# Altium schematic sheet 0256_GPU_VDDQ_VCCSAMC_V.SchDoc
size 848 x 558 mm
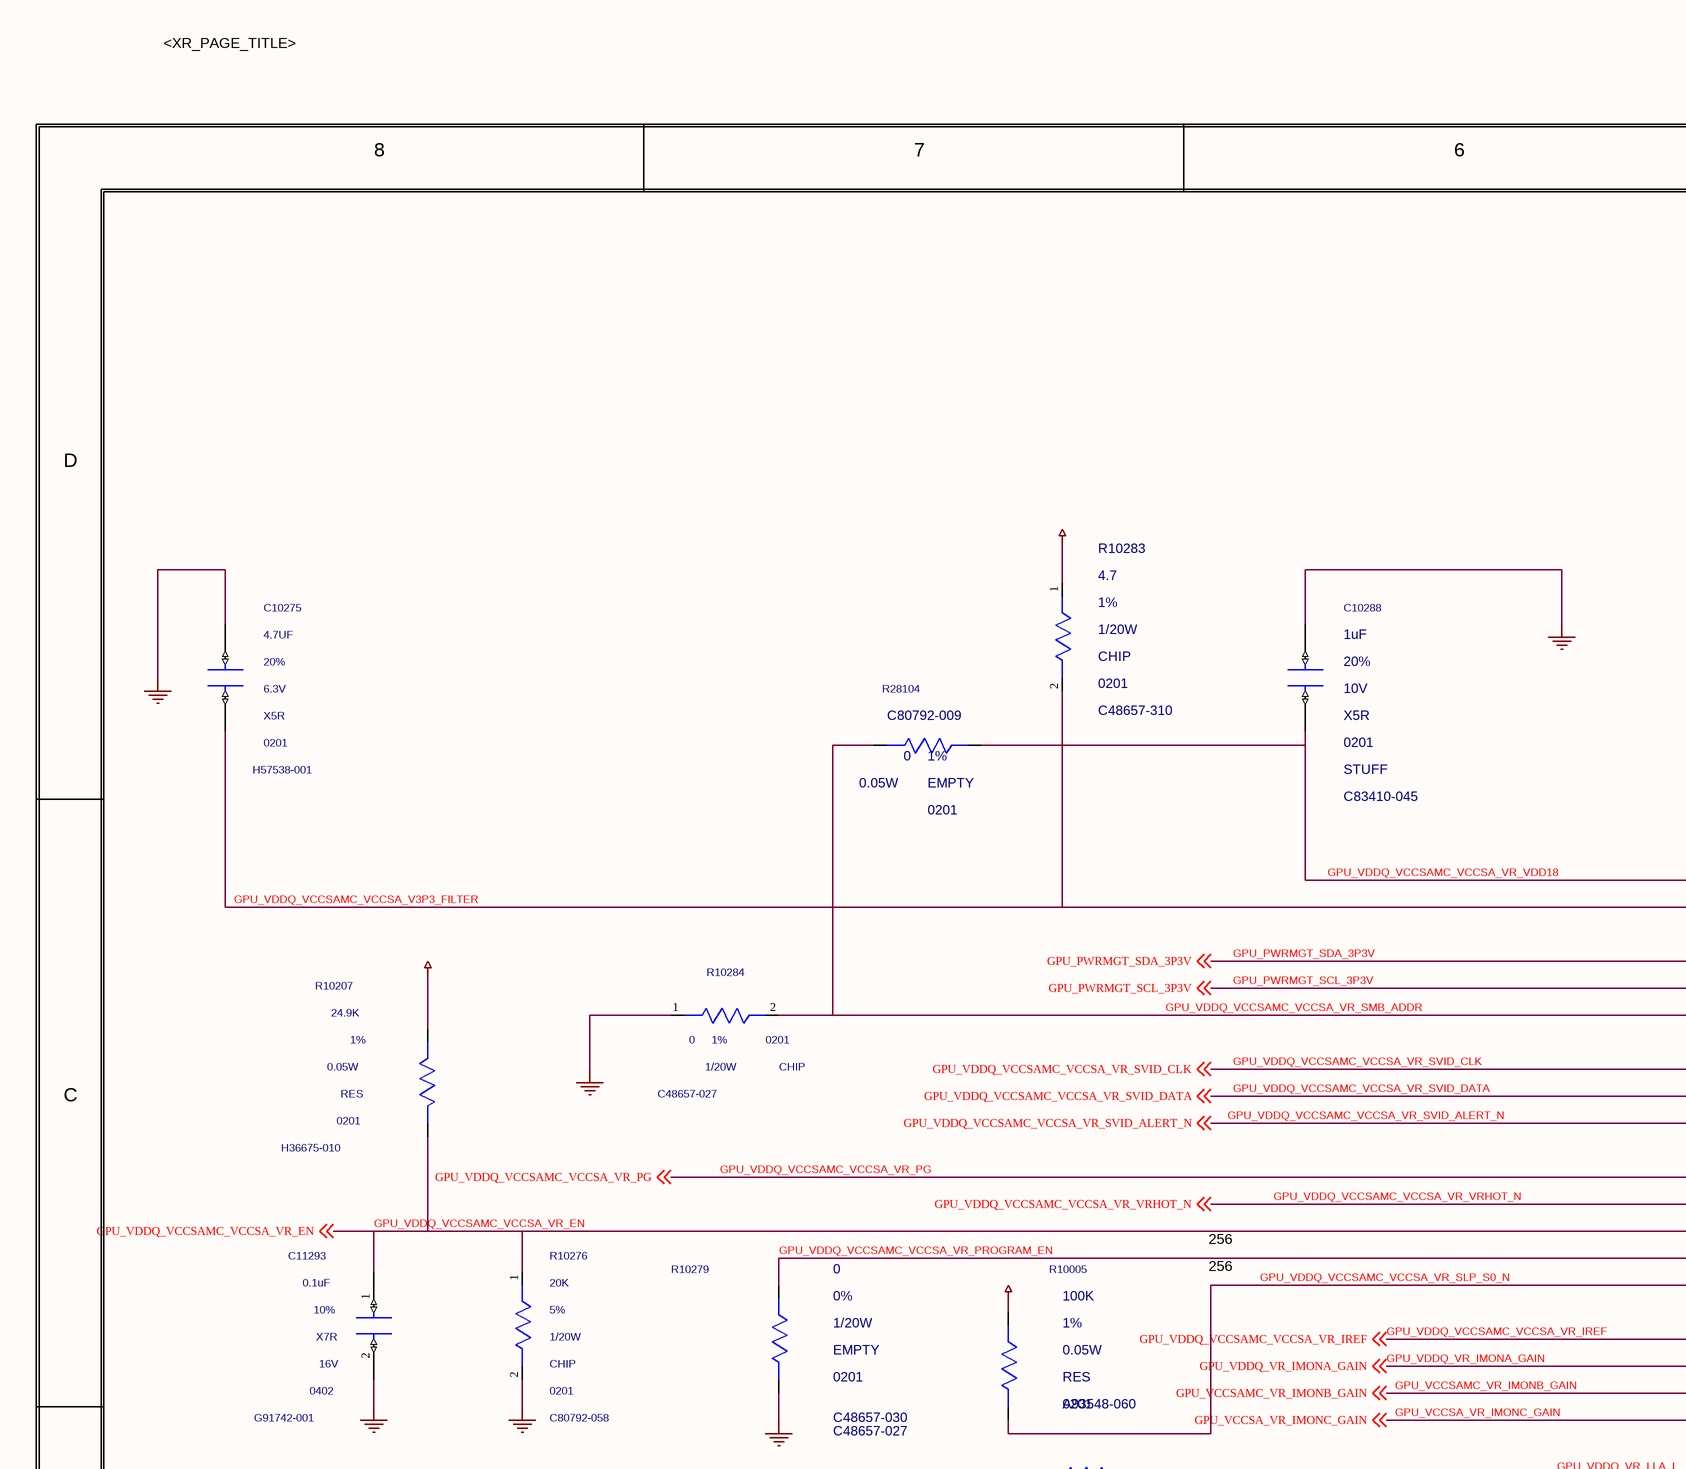
[diagram p0: 0256_GPU_VDDQ_VCCSAMC_V.SchDoc, top left]
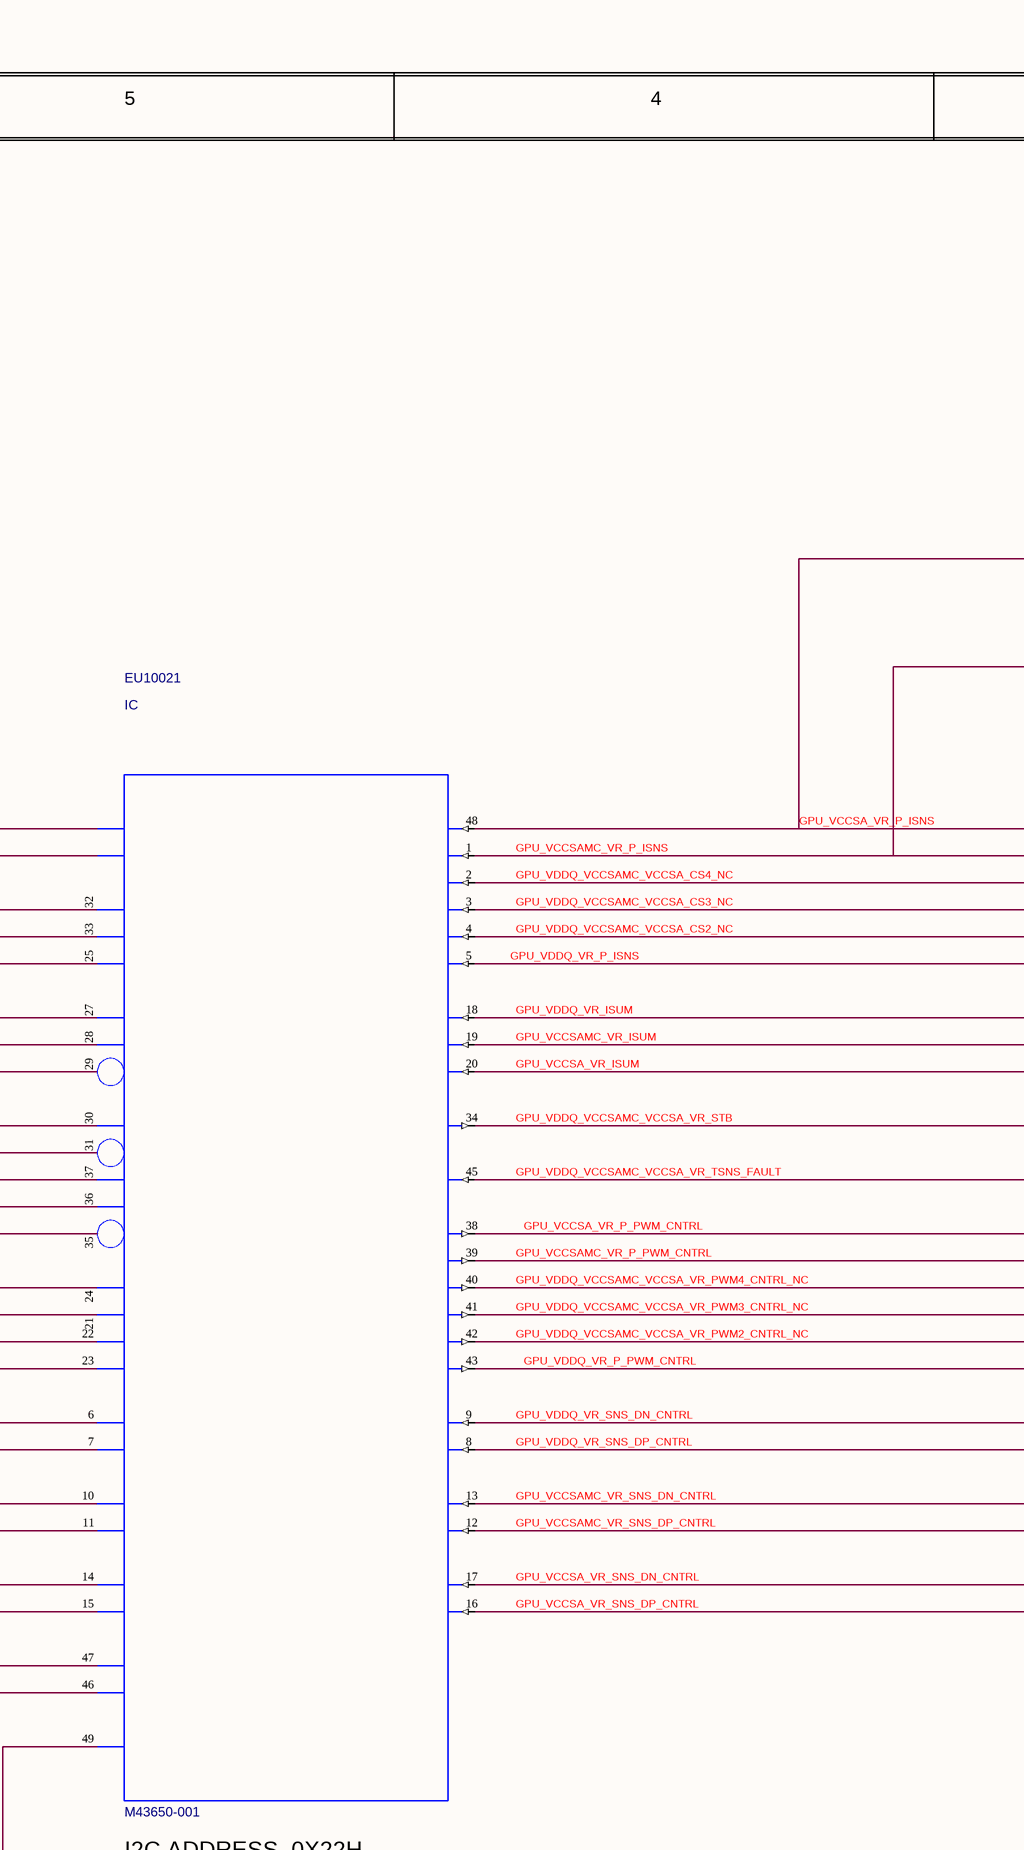
[diagram p1: 0256_GPU_VDDQ_VCCSAMC_V.SchDoc, top middle]
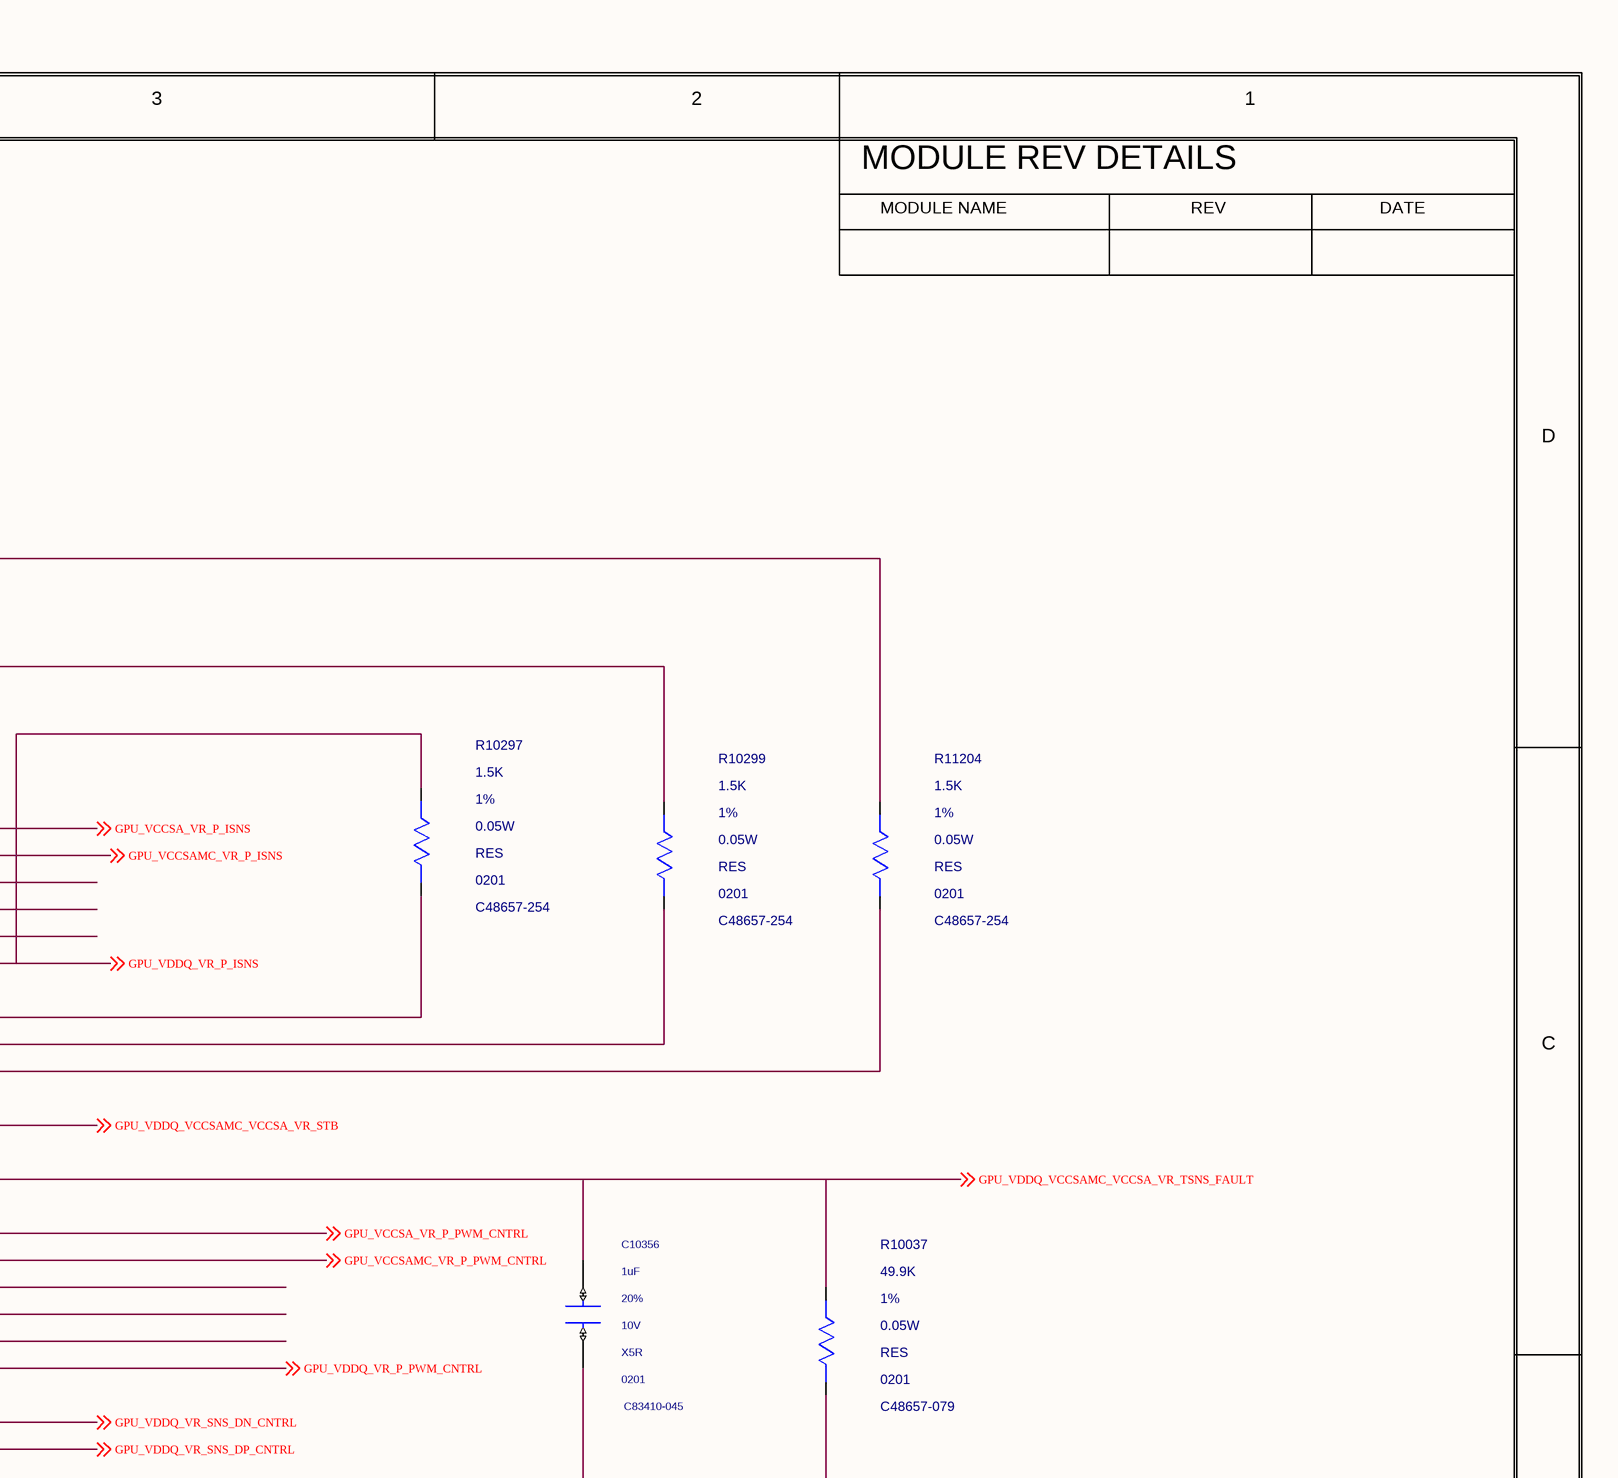
[diagram p2: 0256_GPU_VDDQ_VCCSAMC_V.SchDoc, top right]
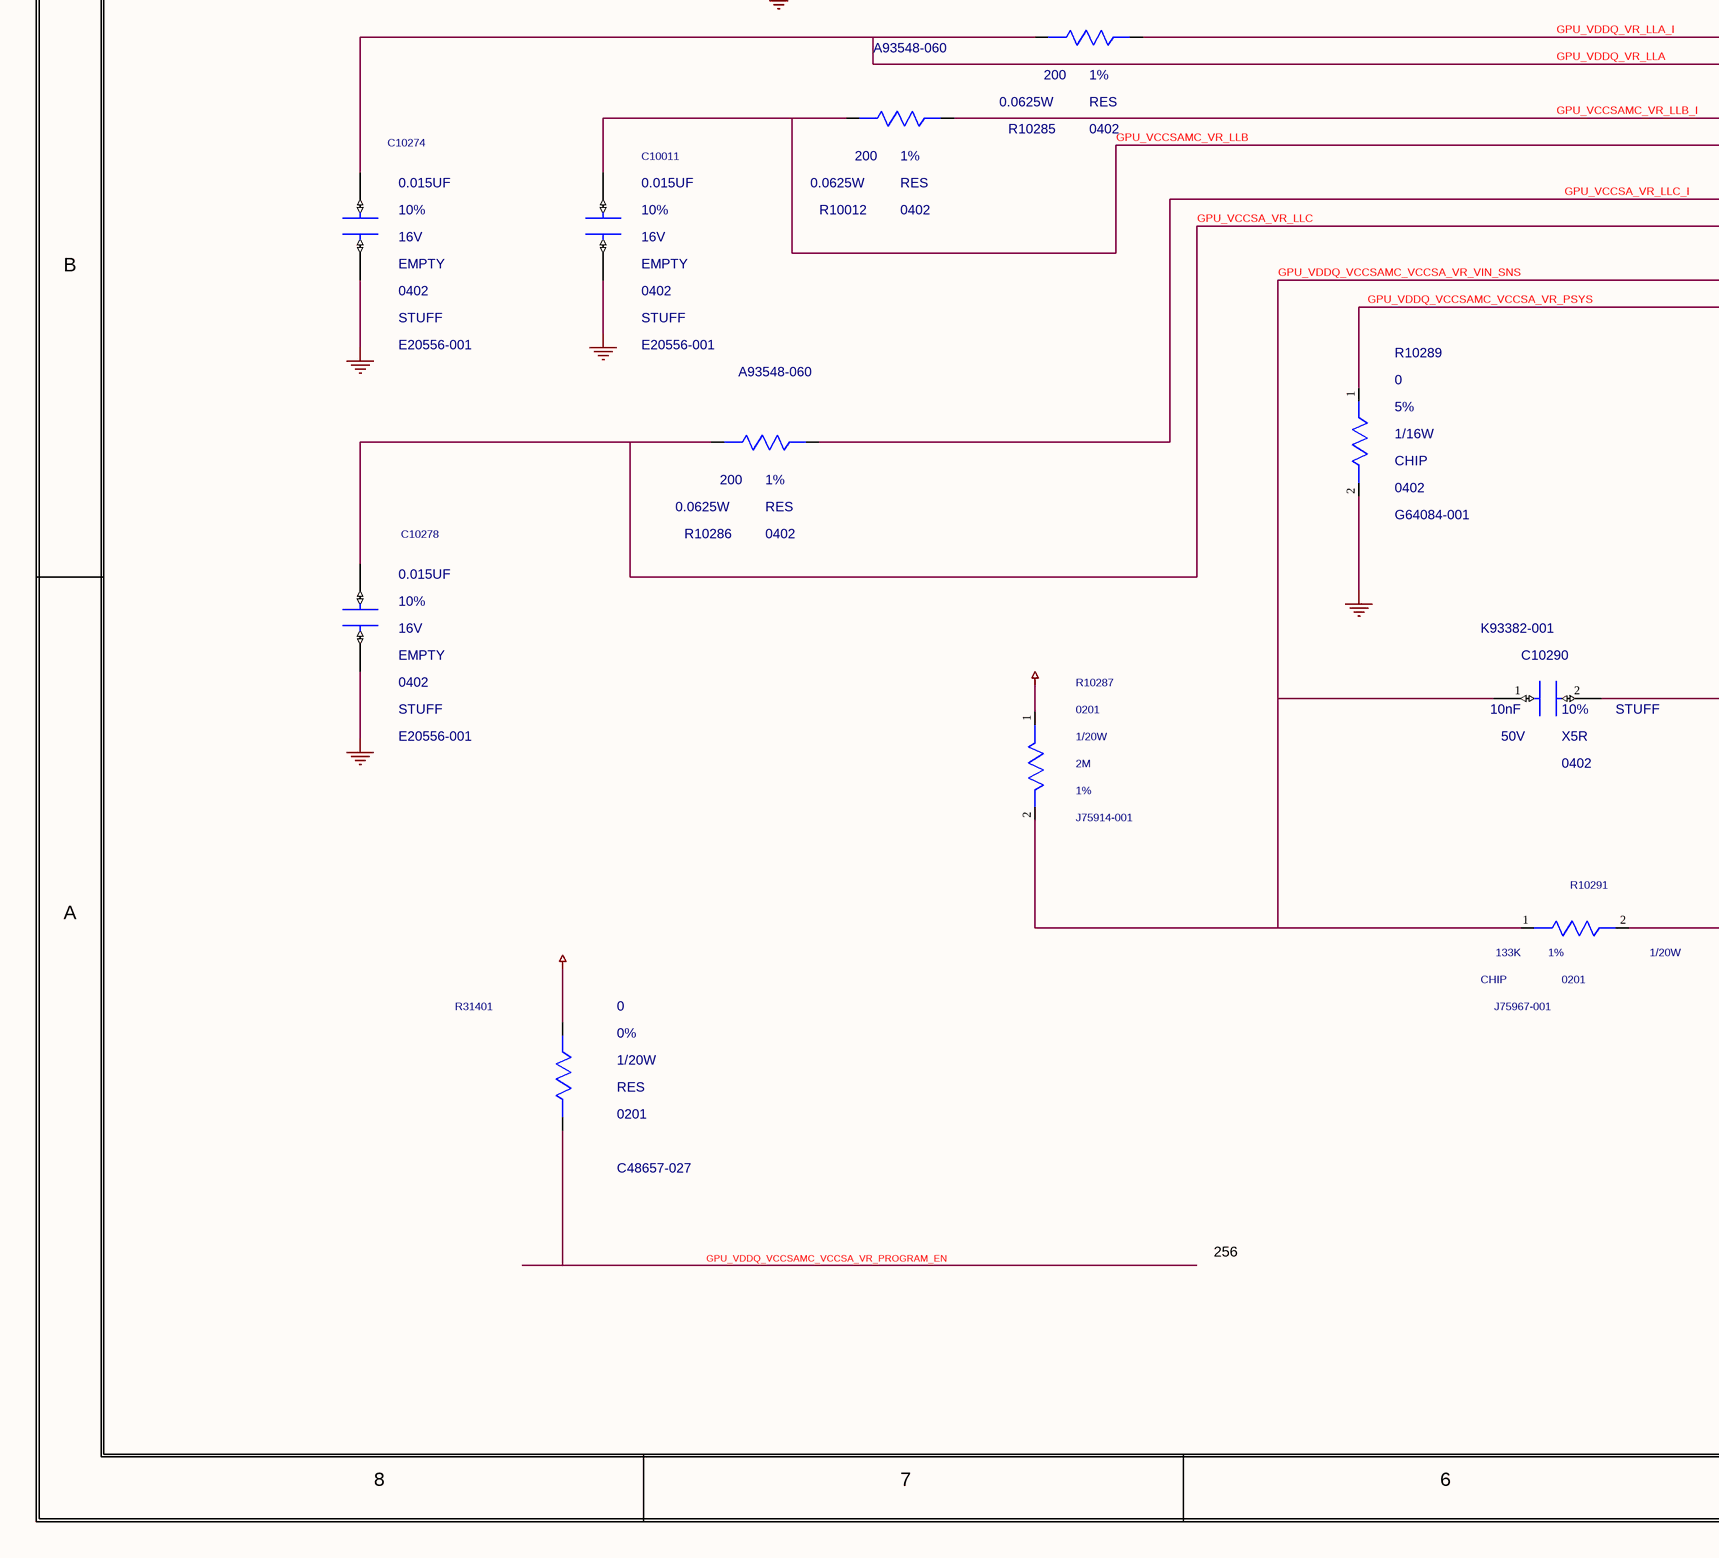
[diagram p3: 0256_GPU_VDDQ_VCCSAMC_V.SchDoc, bottom left]
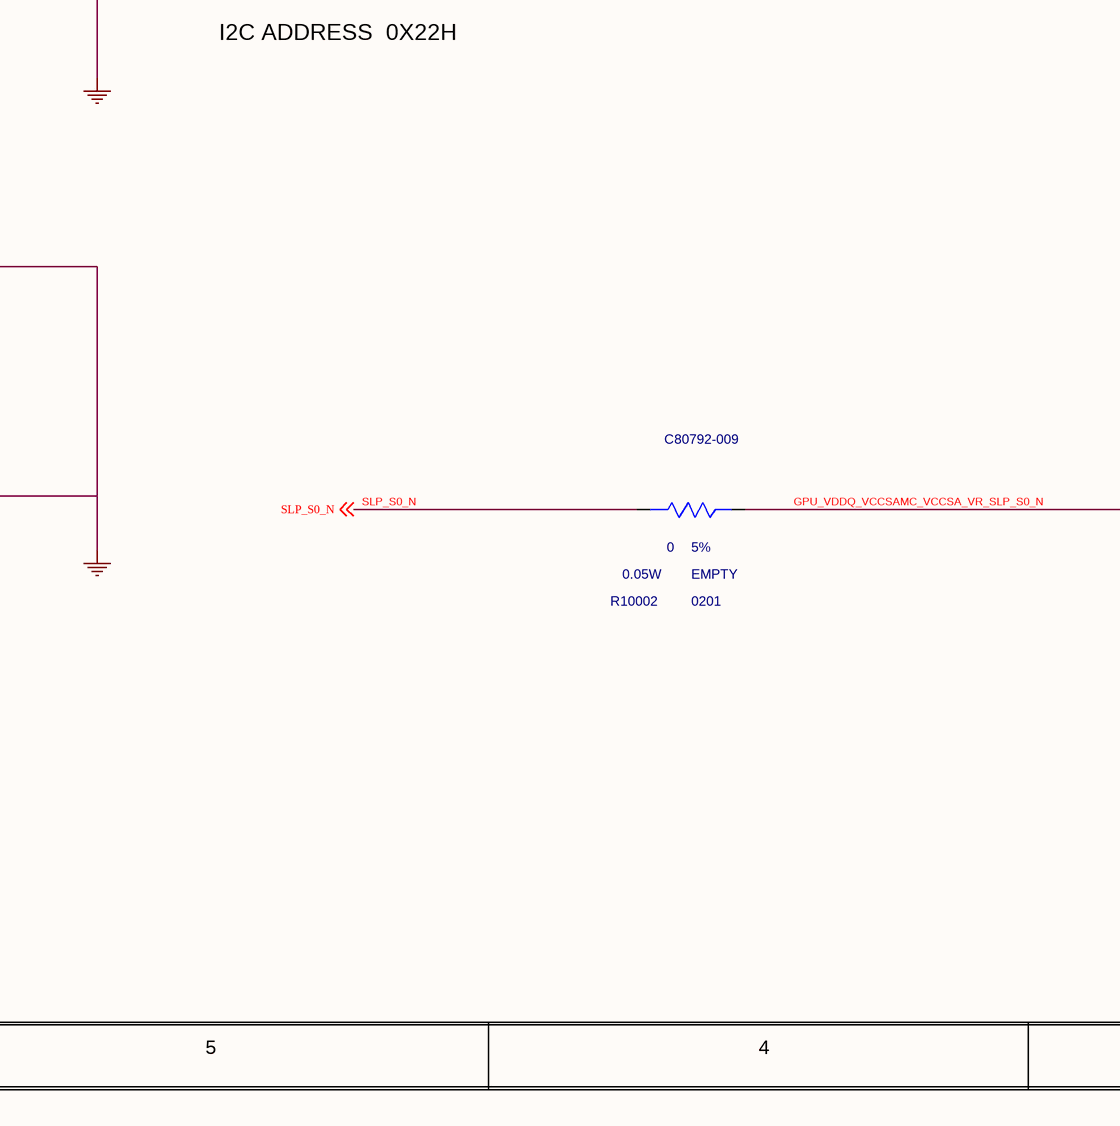
[diagram p4: 0256_GPU_VDDQ_VCCSAMC_V.SchDoc, bottom middle]
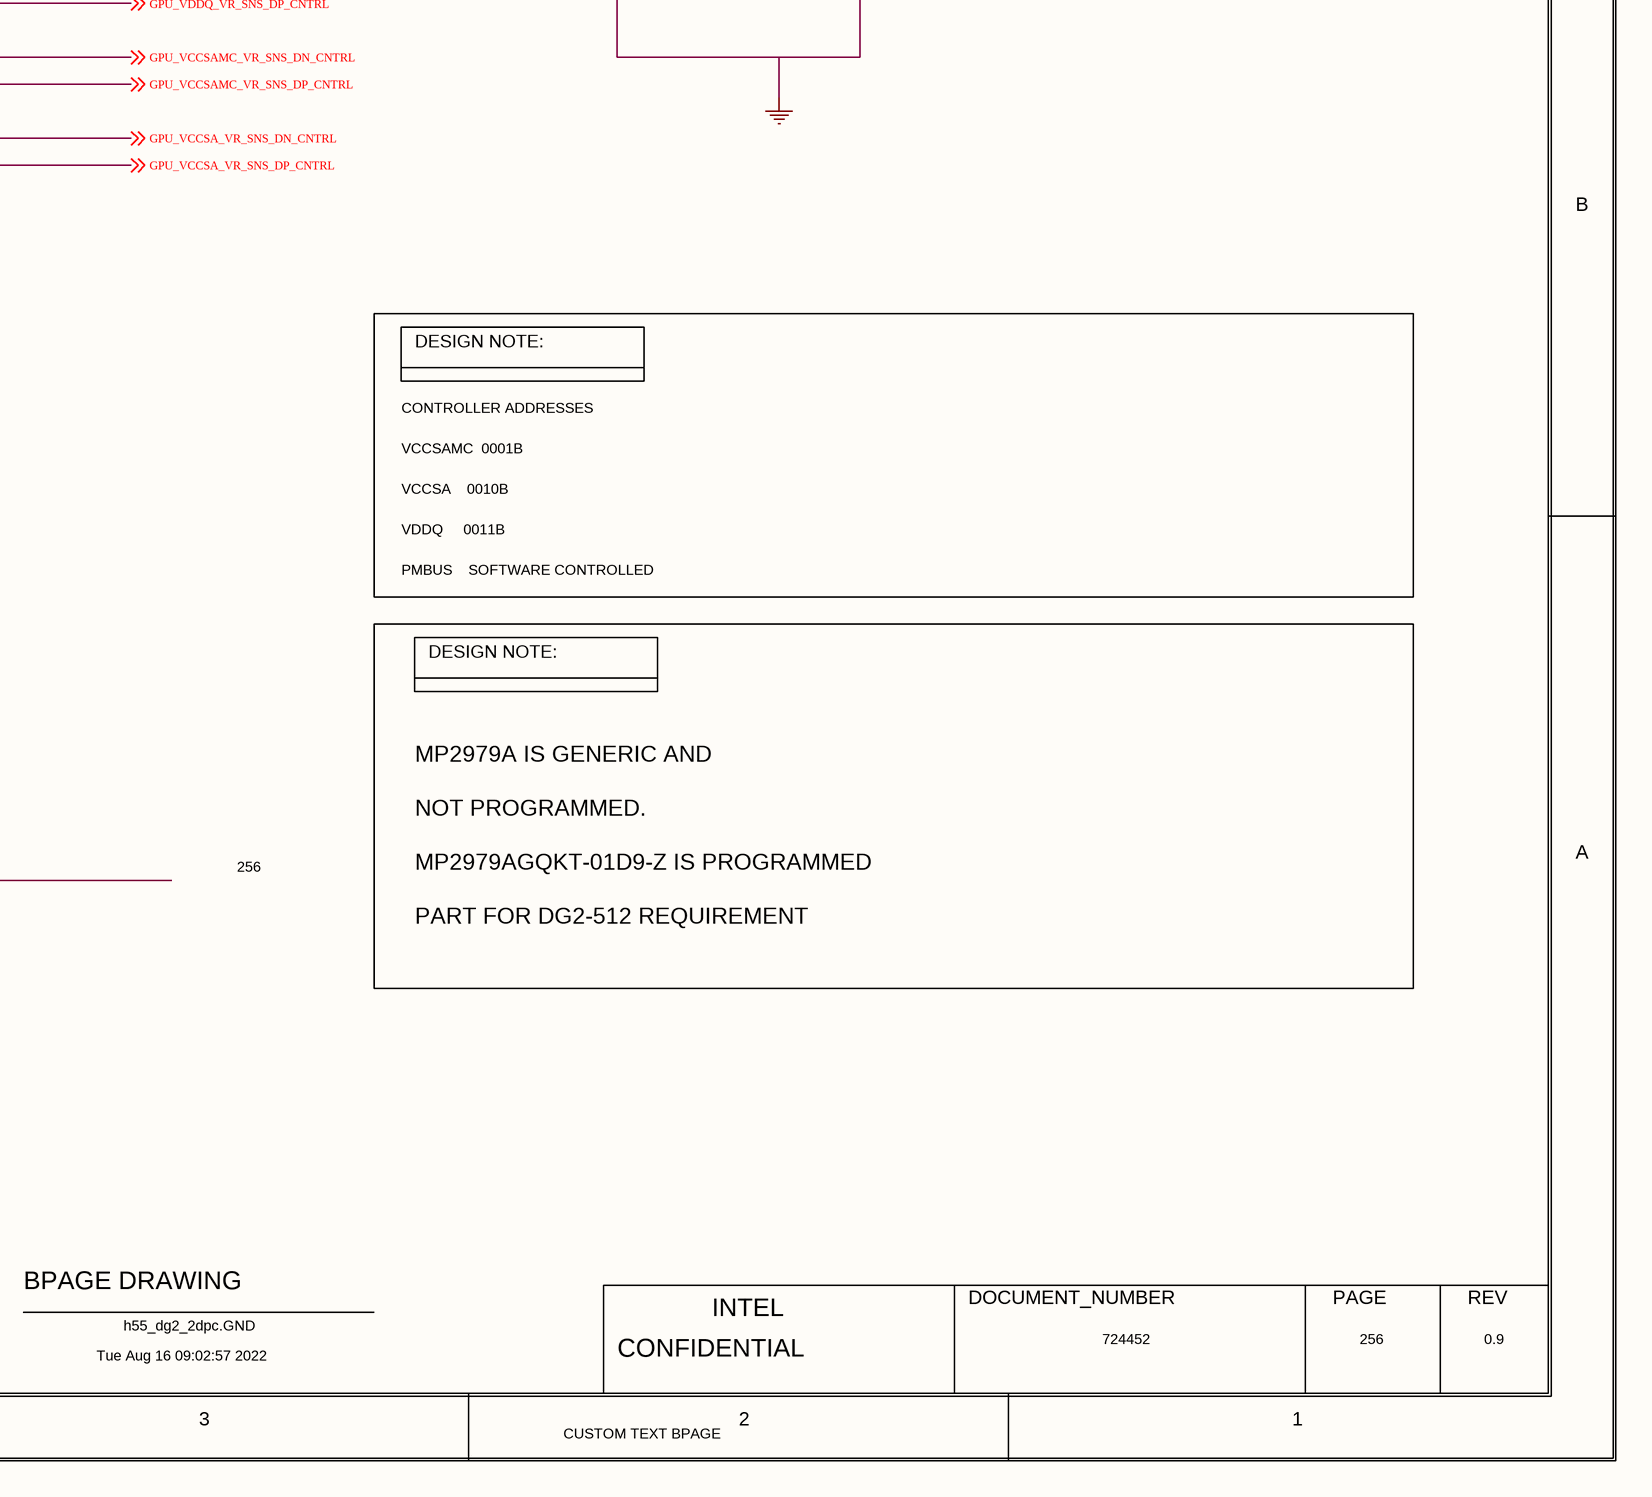
[diagram p5: 0256_GPU_VDDQ_VCCSAMC_V.SchDoc, bottom right]

## Parts
C10011  0.015UF  BOM_USE: STUFF  MATERIAL: EMPTY  PACK_TYPE: 0402  PART_NUMBER: E20556-001  TOLERANCE: 10%  VOLTAGE: 16V  [TK0_SM0402_1050X550_MB]
C10274  0.015UF  BOM_USE: STUFF  MATERIAL: EMPTY  PACK_TYPE: 0402  PART_NUMBER: E20556-001  TOLERANCE: 10%  VOLTAGE: 16V  [TK0_SM0402_1050X550_MB]
C10275  4.7UF  MATERIAL: X5R  PACK_TYPE: 0201  PART_NUMBER: H57538-001  TOLERANCE: 20%  VOLTAGE: 6.3V  [CTK0_SM0201_690X390_MA]
C10278  0.015UF  BOM_USE: STUFF  MATERIAL: EMPTY  PACK_TYPE: 0402  PART_NUMBER: E20556-001  TOLERANCE: 10%  VOLTAGE: 16V  [TK0_SM0402_1050X550_MB]
C10288  1uF  BOM_USE: STUFF  MATERIAL: X5R  PACK_TYPE: 0201  PART_NUMBER: C83410-045  TOLERANCE: 20%  VOLTAGE: 10V  [TK0_SM0201_690X390_MA]
C10290  10nF  BOM_USE: STUFF  MATERIAL: X5R  PACK_TYPE: 0402  PART_NUMBER: K93382-001  TOLERANCE: 10%  VOLTAGE: 50V  [TK0_SM0402_1050X550_MO]
C10356  1uF  MATERIAL: X5R  PACK_TYPE: 0201  PART_NUMBER: C83410-045  TOLERANCE: 20%  VOLTAGE: 10V  [CTK0_SM0201_690X390_MA]
C11293  0.1uF  MATERIAL: X7R  PACK_TYPE: 0402  PART_NUMBER: G91742-001  TOLERANCE: 10%  VOLTAGE: 16V  [SMC0402IA]
EU10021  MATERIAL: IC  PART_NUMBER: M43650-001  [CTK2_LCC48_S6100_400_DFS4650_MA]  (hidden comment: C_MP2979A)
R10002  0  MATERIAL: EMPTY  PACK_TYPE: 0201  PART_NUMBER: C80792-009  TOLERANCE: 5%  WATTAGE: 0.05W  [CTK2_SM0201_630X330_MA]
R10005  100K  MATERIAL: RES  PACK_TYPE: 0201  PART_NUMBER: C48657-030  TOLERANCE: 1%  WATTAGE: 0.05W  [TK0_SM0201_630X330_MC]
R10012  200  MATERIAL: RES  PACK_TYPE: 0402  PART_NUMBER: A93548-060  TOLERANCE: 1%  WATTAGE: 0.0625W  [CTK0_SM0402_1100X550_MA]
R10037  49.9K  MATERIAL: RES  PACK_TYPE: 0201  PART_NUMBER: C48657-079  TOLERANCE: 1%  WATTAGE: 0.05W  [TK0_SM0201_650X350_MB]
R10207  24.9K  MATERIAL: RES  PACK_TYPE: 0201  PART_NUMBER: H36675-010  TOLERANCE: 1%  WATTAGE: 0.05W  [CTK0_SM0201_630X330_MA]
R10276  20K  MATERIAL: CHIP  PACK_TYPE: 0201  PART_NUMBER: C80792-058  TOLERANCE: 5%  WATTAGE: 1/20W  [SMR0201IA]
R10279  0  MATERIAL: EMPTY  PACK_TYPE: 0201  PART_NUMBER: C48657-027  TOLERANCE: 0%  WATTAGE: 1/20W  [TK0_SM0201_630X330_MB]
R10283  4.7  MATERIAL: CHIP  PACK_TYPE: 0201  PART_NUMBER: C48657-310  TOLERANCE: 1%  WATTAGE: 1/20W  [SMR0201IA]
R10284  0  MATERIAL: CHIP  PACK_TYPE: 0201  PART_NUMBER: C48657-027  TOLERANCE: 1%  WATTAGE: 1/20W  [SMR0201IA]
R10285  200  MATERIAL: RES  PACK_TYPE: 0402  PART_NUMBER: A93548-060  TOLERANCE: 1%  WATTAGE: 0.0625W  [CTK0_SM0402_1100X550_MA]
R10286  200  MATERIAL: RES  PACK_TYPE: 0402  PART_NUMBER: A93548-060  TOLERANCE: 1%  WATTAGE: 0.0625W  [CTK0_SM0402_1100X550_MA]
R10287  2M  PACK_TYPE: 0201  PART_NUMBER: J75914-001  TOLERANCE: 1%  WATTAGE: 1/20W  [SMR0201IA]
R10289  0  MATERIAL: CHIP  PACK_TYPE: 0402  PART_NUMBER: G64084-001  TOLERANCE: 5%  WATTAGE: 1/16W  [SMR0402IA]
R10291  133K  MATERIAL: CHIP  PACK_TYPE: 0201  PART_NUMBER: J75967-001  TOLERANCE: 1%  WATTAGE: 1/20W  [SMR0201IA]
R10297  1.5K  MATERIAL: RES  PACK_TYPE: 0201  PART_NUMBER: C48657-254  TOLERANCE: 1%  WATTAGE: 0.05W  [TK0_SM0201_630X330_MC]
R10299  1.5K  MATERIAL: RES  PACK_TYPE: 0201  PART_NUMBER: C48657-254  TOLERANCE: 1%  WATTAGE: 0.05W  [TK0_SM0201_630X330_MC]
R11204  1.5K  MATERIAL: RES  PACK_TYPE: 0201  PART_NUMBER: C48657-254  TOLERANCE: 1%  WATTAGE: 0.05W  [TK0_SM0201_630X330_MC]
R28104  0  MATERIAL: EMPTY  PACK_TYPE: 0201  PART_NUMBER: C80792-009  TOLERANCE: 1%  WATTAGE: 0.05W  [TK0_SM0201_630X330_MC]
R31401  0  MATERIAL: RES  PACK_TYPE: 0201  PART_NUMBER: C48657-027  TOLERANCE: 0%  WATTAGE: 1/20W  [TK0_SM0201_630X330_MB]

## Nets
+V3P3S_GPU: R10005.1(A) R10207.1(A) R10283.1(A) R31401.1(A)
+VBATA_DG2: R10287.1(A)
GND: C10011.2(B) C10274.2(B) C10275.1(A) C10278.2(B) C10288.1(A) C10290.2(B) C10356.2(B) C11293.2(B) EU10021.49(AGND_TPD) R10037.2(B) R10276.2(B) R10279.2(B) R10284.1(A) R10289.2(B) R10291.2(B)
VDD18: EU10021.26(VDD18)
VDD33: EU10021.44(VDD33)
GPU_PWRMGT_SCL_3P3V: EU10021.33(SCL_P) ; off-sheet GPU_PWRMGT_SCL_3P3V
GPU_PWRMGT_SDA_3P3V: EU10021.32(SDA_P) ; off-sheet GPU_PWRMGT_SDA_3P3V
GPU_VCCSA_VR_IMONC_GAIN: EU10021.23(IMONC) ; off-sheet GPU_VCCSA_VR_IMONC_GAIN
GPU_VCCSA_VR_ISUM: EU10021.20(CS_SUMC) R11204.2(B)
GPU_VCCSA_VR_LLC: C10278.1(A) EU10021.15(VFBC) R10286.1(A)
GPU_VCCSA_VR_LLC_I: EU10021.14(VDIFFC) R10286.2(B)
GPU_VCCSA_VR_P_ISNS: EU10021.48(CS6) R11204.1(A) ; off-sheet GPU_VCCSA_VR_P_ISNS
GPU_VCCSA_VR_P_PWM_CNTRL: EU10021.38(PWM6) ; off-sheet GPU_VCCSA_VR_P_PWM_CNTRL
GPU_VCCSA_VR_SNS_DN_CNTRL: EU10021.17(VORTNC) ; off-sheet GPU_VCCSA_VR_SNS_DN_CNTRL
GPU_VCCSA_VR_SNS_DP_CNTRL: EU10021.16(VOSENC) ; off-sheet GPU_VCCSA_VR_SNS_DP_CNTRL
GPU_VCCSAMC_VR_IMONB_GAIN: EU10021.22(IMONB) ; off-sheet GPU_VCCSAMC_VR_IMONB_GAIN
GPU_VCCSAMC_VR_ISUM: EU10021.19(CS_SUMB) R10299.2(B)
GPU_VCCSAMC_VR_LLB: C10011.1(A) EU10021.11(VFBB) R10012.1(A)
GPU_VCCSAMC_VR_LLB_I: EU10021.10(VDIFFB) R10012.2(B)
GPU_VCCSAMC_VR_P_ISNS: EU10021.1(CS5) R10299.1(A) ; off-sheet GPU_VCCSAMC_VR_P_ISNS
GPU_VCCSAMC_VR_P_PWM_CNTRL: EU10021.39(PWM5) ; off-sheet GPU_VCCSAMC_VR_P_PWM_CNTRL
GPU_VCCSAMC_VR_SNS_DN_CNTRL: EU10021.13(VORTNB) ; off-sheet GPU_VCCSAMC_VR_SNS_DN_CNTRL
GPU_VCCSAMC_VR_SNS_DP_CNTRL: EU10021.12(VOSENB) ; off-sheet GPU_VCCSAMC_VR_SNS_DP_CNTRL
GPU_VDDQ_VCCSAMC_VCCSA_CS2_NC: EU10021.4(CS2)
GPU_VDDQ_VCCSAMC_VCCSA_CS3_NC: EU10021.3(CS3)
GPU_VDDQ_VCCSAMC_VCCSA_CS4_NC: EU10021.2(CS4)
GPU_VDDQ_VCCSAMC_VCCSA_V3P3_FILTER: C10275.2(B) R10283.2(B)
GPU_VDDQ_VCCSAMC_VCCSA_VR_EN: C11293.1(A) EU10021.37(EN) R10207.2(B) R10276.1(A) ; off-sheet GPU_VDDQ_VCCSAMC_VCCSA_VR_EN
GPU_VDDQ_VCCSAMC_VCCSA_VR_IREF: EU10021.24(IREF) ; off-sheet GPU_VDDQ_VCCSAMC_VCCSA_VR_IREF
GPU_VDDQ_VCCSAMC_VCCSA_VR_PG: EU10021.30(VRRDY) ; off-sheet GPU_VDDQ_VCCSAMC_VCCSA_VR_PG
GPU_VDDQ_VCCSAMC_VCCSA_VR_PROGRAM_EN: EU10021.36(PE) R10279.1(A) R31401.2(B)
GPU_VDDQ_VCCSAMC_VCCSA_VR_PSYS: EU10021.46(PSYS) R10289.1(A)
GPU_VDDQ_VCCSAMC_VCCSA_VR_PWM2_CNTRL_NC: EU10021.42(PWM2)
GPU_VDDQ_VCCSAMC_VCCSA_VR_PWM3_CNTRL_NC: EU10021.41(PWM3)
GPU_VDDQ_VCCSAMC_VCCSA_VR_PWM4_CNTRL_NC: EU10021.40(PWM4)
GPU_VDDQ_VCCSAMC_VCCSA_VR_SLP_S0_N: EU10021.35(SLP_S0_N) R10002.2(B) R10005.2(B)
GPU_VDDQ_VCCSAMC_VCCSA_VR_SMB_ADDR: EU10021.25(ADDR_P) R10284.2(B) R28104.1(A)
GPU_VDDQ_VCCSAMC_VCCSA_VR_STB: EU10021.34(STB) ; off-sheet GPU_VDDQ_VCCSAMC_VCCSA_VR_STB
GPU_VDDQ_VCCSAMC_VCCSA_VR_SVID_ALERT_N: EU10021.29(ALT_N) ; off-sheet GPU_VDDQ_VCCSAMC_VCCSA_VR_SVID_ALERT_N
GPU_VDDQ_VCCSAMC_VCCSA_VR_SVID_CLK: EU10021.27(SCLK) ; off-sheet GPU_VDDQ_VCCSAMC_VCCSA_VR_SVID_CLK
GPU_VDDQ_VCCSAMC_VCCSA_VR_SVID_DATA: EU10021.28(SDIO) ; off-sheet GPU_VDDQ_VCCSAMC_VCCSA_VR_SVID_DATA
GPU_VDDQ_VCCSAMC_VCCSA_VR_TSNS_FAULT: C10356.1(A) EU10021.45(TEMP) R10037.1(A) ; off-sheet GPU_VDDQ_VCCSAMC_VCCSA_VR_TSNS_FAULT
GPU_VDDQ_VCCSAMC_VCCSA_VR_VDD18: C10288.2(B) R28104.2(B)
GPU_VDDQ_VCCSAMC_VCCSA_VR_VIN_SNS: C10290.1(A) EU10021.47(VIN_SEN) R10287.2(B) R10291.1(A)
GPU_VDDQ_VCCSAMC_VCCSA_VR_VRHOT_N: EU10021.31(VRHOT_N) ; off-sheet GPU_VDDQ_VCCSAMC_VCCSA_VR_VRHOT_N
GPU_VDDQ_VR_IMONA_GAIN: EU10021.21(IMONA) ; off-sheet GPU_VDDQ_VR_IMONA_GAIN
GPU_VDDQ_VR_ISUM: EU10021.18(CS_SUMA) R10297.2(B)
GPU_VDDQ_VR_LLA: C10274.1(A) EU10021.7(VFBA) R10285.1(A)
GPU_VDDQ_VR_LLA_I: EU10021.6(VDIFFA) R10285.2(B)
GPU_VDDQ_VR_P_ISNS: EU10021.5(CS1) R10297.1(A) ; off-sheet GPU_VDDQ_VR_P_ISNS
GPU_VDDQ_VR_P_PWM_CNTRL: EU10021.43(PWM1) ; off-sheet GPU_VDDQ_VR_P_PWM_CNTRL
GPU_VDDQ_VR_SNS_DN_CNTRL: EU10021.9(VORTNA) ; off-sheet GPU_VDDQ_VR_SNS_DN_CNTRL
GPU_VDDQ_VR_SNS_DP_CNTRL: EU10021.8(VOSENA) ; off-sheet GPU_VDDQ_VR_SNS_DP_CNTRL
SLP_S0_N: R10002.1(A) ; off-sheet SLP_S0_N

## Notes on the sheet
- <XR_PAGE_TITLE>
- 8
- 7
- 6
- 5
- 4
- 3
- 2
- 1
- MODULE REV DETAILS
- MODULE NAME
- REV
- DATE
- D
- C
- 256
- B
- DESIGN NOTE:
- I2C ADDRESS  0X22H
- CONTROLLER ADDRESSES
- VCCSA    0010B
- VCCSAMC  0001B
- VDDQ     0011B
- PMBUS    SOFTWARE CONTROLLED
- MP2979A IS GENERIC AND
- NOT PROGRAMMED.
- A
- MP2979AGQKT-01D9-Z IS PROGRAMMED
- PART FOR DG2-512 REQUIREMENT
- BPAGE DRAWING
- INTEL
- DOCUMENT_NUMBER
- PAGE
- Tue Aug 16 09:02:57 2022
- h55_dg2_2dpc.GND
- CONFIDENTIAL
- 724452
- 0.9
- CUSTOM TEXT BPAGE

## Library data of the parts
C10011 = CAP_2: CDS_PHYS_PART_NAME: CAP_2_0402-E20556-001,EMPTY,0.015UF,16V,10%,TK0,GENERIC; CDS_LMAN_SYM_OUTLINE: -50,50,50,-50; FP_TECH: TK0; IP: GENERIC; ROOM: NONE; OriginalSymbolOrigin: (-50,25); XY: (825,1950); VER: 1; ROT: 0; PHYS_PAGE: 256; LOCATION: C10011; DRAWING: @RVP1_ADL_SB_ADP_S_DDR5_SODIMM_2DPC_LIB.H55_DG2_2DPC(SCH_1):PAGE368; CDS_LIB: discrete_2; VARIANT: ?; PCB Footprint: TK0_SM0402_1050X550_MB; CHIPS_PART_NAME: CAP_2; CDS_PART_NAME: CAP_2_0402-E20556-001,EMPTY,0.015UF,16V,10%,TK0,GENERIC; CDS_LOCATION: C10011
C10274 = CAP_2: CDS_PHYS_PART_NAME: CAP_2_0402-E20556-001,EMPTY,0.015UF,16V,10%,TK0,GENERIC; CDS_LMAN_SYM_OUTLINE: -50,50,50,-50; FP_TECH: TK0; IP: GENERIC; ROOM: NONE; OriginalSymbolOrigin: (-50,25); XY: (375,1950); VER: 1; ROT: 0; PHYS_PAGE: 256; LOCATION: C10274; DRAWING: @RVP1_ADL_SB_ADP_S_DDR5_SODIMM_2DPC_LIB.H55_DG2_2DPC(SCH_1):PAGE368; CDS_LIB: discrete_2; VARIANT: ?; PCB Footprint: TK0_SM0402_1050X550_MB; CHIPS_PART_NAME: CAP_2; CDS_PART_NAME: CAP_2_0402-E20556-001,EMPTY,0.015UF,16V,10%,TK0,GENERIC; CDS_LOCATION: C10274
C10275 = C_CAP: CDS_PHYS_PART_NAME: C_CAP_0201-H57538-001,X5R,4.7UF,6.3V,20%,TK0,GENERIC; CDS_LMAN_SYM_OUTLINE: -50,50,50,-50; FP_TECH: TK0; IP: GENERIC; ROOM: NONE; OriginalSymbolOrigin: (-50,25); XY: (125,3775); VER: 1; ROT: 0; PHYS_PAGE: 256; LOCATION: C10275; DRAWING: @RVP1_ADL_SB_ADP_S_DDR5_SODIMM_2DPC_LIB.H55_DG2_2DPC(SCH_1):PAGE368; CDS_LIB: c_discrete; VARIANT: ?; PCB Footprint: CTK0_SM0201_690X390_MA; CHIPS_PART_NAME: C_CAP; CDS_PART_NAME: C_CAP_0201-H57538-001,X5R,4.7UF,6.3V,20%,TK0,GENERIC; CDS_LOCATION: C10275
C10278 = CAP_2: CDS_PHYS_PART_NAME: CAP_2_0402-E20556-001,EMPTY,0.015UF,16V,10%,TK0,GENERIC; CDS_LMAN_SYM_OUTLINE: -50,50,50,-50; FP_TECH: TK0; IP: GENERIC; ROOM: NONE; OriginalSymbolOrigin: (-50,25); XY: (375,1225); VER: 1; ROT: 0; PHYS_PAGE: 256; LOCATION: C10278; DRAWING: @RVP1_ADL_SB_ADP_S_DDR5_SODIMM_2DPC_LIB.H55_DG2_2DPC(SCH_1):PAGE368; CDS_LIB: discrete_2; VARIANT: ?; PCB Footprint: TK0_SM0402_1050X550_MB; CHIPS_PART_NAME: CAP_2; CDS_PART_NAME: CAP_2_0402-E20556-001,EMPTY,0.015UF,16V,10%,TK0,GENERIC; CDS_LOCATION: C10278
C10288 = CAP_2: CDS_PHYS_PART_NAME: CAP_2_0201-C83410-045,X5R,1UF,10V,20%,TK0,GENERIC; CDS_LMAN_SYM_OUTLINE: -50,50,50,-50; FP_TECH: TK0; IP: GENERIC; ROOM: NONE; OriginalSymbolOrigin: (-50,25); XY: (2125,3775); VER: 1; ROT: 0; PHYS_PAGE: 256; LOCATION: C10288; DRAWING: @RVP1_ADL_SB_ADP_S_DDR5_SODIMM_2DPC_LIB.H55_DG2_2DPC(SCH_1):PAGE368; CDS_LIB: discrete_2; VARIANT: ?; PCB Footprint: TK0_SM0201_690X390_MA; CHIPS_PART_NAME: CAP_2; CDS_PART_NAME: CAP_2_0201-C83410-045,X5R,1UF,10V,20%,TK0,GENERIC; CDS_LOCATION: C10288
C10290 = CAP_2#1: CHIPS_PART_NAME: CAP_2; CDS_PHYS_PART_NAME: CAP_2_0402-K93382-001,X5R,10NF,50V,10%,TK0,GENERIC; CDS_LMAN_SYM_OUTLINE: -50,50,50,-50; FP_TECH: TK0; IP: GENERIC; ROOM: NONE; OriginalSymbolOrigin: (-25,50); XY: (2575,1075); VER: 2; ROT: 0; PHYS_PAGE: 256; LOCATION: C10290; DRAWING: @RVP1_ADL_SB_ADP_S_DDR5_SODIMM_2DPC_LIB.H55_DG2_2DPC(SCH_1):PAGE368; CDS_LIB: discrete_2; VARIANT: ?; PCB Footprint: TK0_SM0402_1050X550_MO; CDS_PART_NAME: CAP_2_0402-K93382-001,X5R,10NF,50V,10%,TK0,GENERIC; CDS_LOCATION: C10290
C10356 = C_CAP: CDS_PHYS_PART_NAME: C_CAP_0201-C83410-045,X5R,1UF,10V,20%,TK0,GENERIC; CDS_LMAN_SYM_OUTLINE: -50,50,50,-50; FP_TECH: TK0; IP: GENERIC; ROOM: NONE; OriginalSymbolOrigin: (-50,25); XY: (6175,2500); VER: 1; ROT: 0; PHYS_PAGE: 256; LOCATION: C10356; DRAWING: @RVP1_ADL_SB_ADP_S_DDR5_SODIMM_2DPC_LIB.H55_DG2_2DPC(SCH_1):PAGE368; CDS_LIB: c_discrete; VARIANT: ?; PCB Footprint: CTK0_SM0201_690X390_MA; CHIPS_PART_NAME: C_CAP; CDS_PART_NAME: C_CAP_0201-C83410-045,X5R,1UF,10V,20%,TK0,GENERIC; CDS_LOCATION: C10356
C11293 = CAP: CDS_PHYS_PART_NAME: CAP_0402-G91742-001,X7R,0.1UF,16V,10%,LPDB,GENERIC; OriginalSymbolOrigin: (-50,25); XY: (400,2575); VER: 1; ROT: 0; PHYS_PAGE: 256; LOCATION: C11293; DRAWING: @RVP1_ADL_SB_ADP_S_DDR5_SODIMM_2DPC_LIB.H55_DG2_2DPC(SCH_1):PAGE368; CDS_LIB: discrete; PCB Footprint: SMC0402IA; CHIPS_PART_NAME: CAP; CDS_PART_NAME: CAP_0402-G91742-001,X7R,0.1UF,16V,10%,LPDB,GENERIC; CDS_LOCATION: C11293
EU10021 = C_MP2979A: CDS_PHYS_PART_NAME: C_MP2979A_LCC-M43650-001,IC,MP2979AGQKT-01D9-Z,TK2,GENERIC; CDS_LMAN_SYM_OUTLINE: -300,950,300,-950; FP_TECH: TK2; IP: GENERIC; PACK_TYPE: LCC; ROOM: NONE; OriginalSymbolOrigin: (-350,950); XY: (3700,2550); VER: 1; ROT: 0; PHYS_PAGE: 256; LOCATION: EU10021; DRAWING: @RVP1_ADL_SB_ADP_S_DDR5_SODIMM_2DPC_LIB.H55_DG2_2DPC(SCH_1):PAGE368; CDS_LIB: local; VARIANT: ?; PCB Footprint: CTK2_LCC48_S6100_400_DFS4650_MA; SEC_TYPE: LCC; CHIPS_PART_NAME: C_MP2979A; CDS_PART_NAME: C_MP2979A_LCC-M43650-001,IC,MP2979AGQKT-01D9-Z,TK2,GENERIC; CDS_LOCATION: EU10021
R10002 = C_RES#1: CHIPS_PART_NAME: C_RES; CDS_PHYS_PART_NAME: C_RES_0201-C80792-009,EMPTY,0,5%,0.05W,TK2,GENERIC; CDS_LMAN_SYM_OUTLINE: -50,50,50,-50; FP_TECH: TK2; IP: GENERIC; ROOM: NONE; OriginalSymbolOrigin: (-75,25); XY: (4275,625); VER: 1; PHYS_PAGE: 256; LOCATION: R10002; DRAWING: @RVP1_ADL_SB_ADP_S_DDR5_SODIMM_2DPC_LIB.H55_DG2_2DPC(SCH_1):PAGE368; CDS_LIB: c_discrete; VARIANT: ?; PCB Footprint: CTK2_SM0201_630X330_MA; ROT: 0; CDS_PART_NAME: C_RES_0201-C80792-009,EMPTY,0,5%,0.05W,TK2,GENERIC; CDS_LOCATION: R10002
R10005 = RES_2: CDS_PHYS_PART_NAME: RES_2_0201-C48657-030,RES,100K,1%,0.05W,TK0,GENERIC; BOM_USE: STUFF; CDS_LMAN_SYM_OUTLINE: -50,50,50,-50; FP_TECH: TK0; IP: GENERIC; ROOM: NONE; OriginalSymbolOrigin: (-25,75); XY: (1575,2500); VER: 2; ROT: 0; PHYS_PAGE: 256; LOCATION: R10005; DRAWING: @RVP1_ADL_SB_ADP_S_DDR5_SODIMM_2DPC_LIB.H55_DG2_2DPC(SCH_1):PAGE368; CDS_LIB: discrete_2; VARIANT: ?; PCB Footprint: TK0_SM0201_630X330_MC; CHIPS_PART_NAME: RES_2; CDS_PART_NAME: RES_2_0201-C48657-030,RES,100K,1%,0.05W,TK0,GENERIC; CDS_LOCATION: R10005
R10012 = C_RES#1: CHIPS_PART_NAME: C_RES; CDS_PHYS_PART_NAME: C_RES_0402-A93548-060,RES,200,1%,0.0625W,TK0,GENERIC; CDS_LMAN_SYM_OUTLINE: -50,50,50,-50; FP_TECH: TK0; IP: GENERIC; ROOM: NONE; OriginalSymbolOrigin: (-75,25); XY: (1375,2150); VER: 1; ROT: 0; PHYS_PAGE: 256; LOCATION: R10012; DRAWING: @RVP1_ADL_SB_ADP_S_DDR5_SODIMM_2DPC_LIB.H55_DG2_2DPC(SCH_1):PAGE368; CDS_LIB: c_discrete; VARIANT: ?; PCB Footprint: CTK0_SM0402_1100X550_MA; CDS_PART_NAME: C_RES_0402-A93548-060,RES,200,1%,0.0625W,TK0,GENERIC; CDS_LOCATION: R10012
R10037 = RES_2: CDS_PHYS_PART_NAME: RES_2_0201-C48657-079,RES,49.9K,1%,0.05W,TK0,GENERIC; BOM_USE: STUFF; CDS_LMAN_SYM_OUTLINE: -50,50,50,-50; FP_TECH: TK0; IP: GENERIC; ROOM: NONE; OriginalSymbolOrigin: (-25,75); XY: (6625,2450); VER: 2; ROT: 0; PHYS_PAGE: 256; LOCATION: R10037; DRAWING: @RVP1_ADL_SB_ADP_S_DDR5_SODIMM_2DPC_LIB.H55_DG2_2DPC(SCH_1):PAGE368; CDS_LIB: discrete_2; VARIANT: ?; PCB Footprint: TK0_SM0201_650X350_MB; CHIPS_PART_NAME: RES_2; CDS_PART_NAME: RES_2_0201-C48657-079,RES,49.9K,1%,0.05W,TK0,GENERIC; CDS_LOCATION: R10037
R10207 = C_RES: CDS_PHYS_PART_NAME: C_RES_0201-H36675-010,RES,24.9K,1%,0.05W,TK0,GENERIC; CDS_LMAN_SYM_OUTLINE: -50,50,50,-50; FP_TECH: TK0; IP: GENERIC; ROOM: NONE; OriginalSymbolOrigin: (-25,75); XY: (500,3025); VER: 2; PHYS_PAGE: 256; LOCATION: R10207; DRAWING: @RVP1_ADL_SB_ADP_S_DDR5_SODIMM_2DPC_LIB.H55_DG2_2DPC(SCH_1):PAGE368; CDS_LIB: c_discrete; VARIANT: ?; PCB Footprint: CTK0_SM0201_630X330_MA; ROT: 2; CHIPS_PART_NAME: C_RES; CDS_PART_NAME: C_RES_0201-H36675-010,RES,24.9K,1%,0.05W,TK0,GENERIC; CDS_LOCATION: R10207
R10276 = RES: CDS_PHYS_PART_NAME: RES_0201-C80792-058,CHIP,20K,5%,1/20W,LPDB,GENERIC; OriginalSymbolOrigin: (-25,75); XY: (675,2575); VER: 2; ROT: 0; PHYS_PAGE: 256; LOCATION: R10276; IP: GENERIC; FP_TECH: LPDB; DRAWING: @RVP1_ADL_SB_ADP_S_DDR5_SODIMM_2DPC_LIB.H55_DG2_2DPC(SCH_1):PAGE368; CDS_LIB: discrete; PCB Footprint: SMR0201IA; CHIPS_PART_NAME: RES; CDS_PART_NAME: RES_0201-C80792-058,CHIP,20K,5%,1/20W,LPDB,GENERIC; CDS_LOCATION: R10276
R10279 = RES_2: CDS_PHYS_PART_NAME: RES_2_0201-C48657-027,EMPTY,0,0%,1/20W,TK0,GENERIC; BOM_USE: STUFF; CDS_LMAN_SYM_OUTLINE: -50,50,50,-50; FP_TECH: TK0; IP: GENERIC; ROOM: NONE; OriginalSymbolOrigin: (-25,75); XY: (1150,2550); VER: 2; PHYS_PAGE: 256; LOCATION: R10279; DRAWING: @RVP1_ADL_SB_ADP_S_DDR5_SODIMM_2DPC_LIB.H55_DG2_2DPC(SCH_1):PAGE368; CDS_LIB: discrete_2; VARIANT: ?; PCB Footprint: TK0_SM0201_630X330_MB; ROT: 0; CHIPS_PART_NAME: RES_2; CDS_PART_NAME: RES_2_0201-C48657-027,EMPTY,0,0%,1/20W,TK0,GENERIC; CDS_LOCATION: R10279
R10283 = RES: CDS_PHYS_PART_NAME: RES_0201-C48657-310,CHIP,4.7,1%,1/20W,LPDB,GENERIC; OriginalSymbolOrigin: (-25,75); XY: (1675,3850); VER: 2; ROT: 0; PHYS_PAGE: 256; LOCATION: R10283; IP: GENERIC; FP_TECH: LPDB; DRAWING: @RVP1_ADL_SB_ADP_S_DDR5_SODIMM_2DPC_LIB.H55_DG2_2DPC(SCH_1):PAGE368; CDS_LIB: discrete; PCB Footprint: SMR0201IA; CHIPS_PART_NAME: RES; CDS_PART_NAME: RES_0201-C48657-310,CHIP,4.7,1%,1/20W,LPDB,GENERIC; CDS_LOCATION: R10283
R10284 = RES#1: CHIPS_PART_NAME: RES; CDS_PHYS_PART_NAME: RES_0201-C48657-027,CHIP,0,1%,1/20W,LPDB,GENERIC; OriginalSymbolOrigin: (-75,25); XY: (1050,3150); VER: 1; PHYS_PAGE: 256; LOCATION: R10284; DRAWING: @RVP1_ADL_SB_ADP_S_DDR5_SODIMM_2DPC_LIB.H55_DG2_2DPC(SCH_1):PAGE368; CDS_LIB: discrete; PCB Footprint: SMR0201IA; ROT: 0; CDS_PART_NAME: RES_0201-C48657-027,CHIP,0,1%,1/20W,LPDB,GENERIC; CDS_LOCATION: R10284
R10285 = C_RES#1: CHIPS_PART_NAME: C_RES; CDS_PHYS_PART_NAME: C_RES_0402-A93548-060,RES,200,1%,0.0625W,TK0,GENERIC; CDS_LMAN_SYM_OUTLINE: -50,50,50,-50; FP_TECH: TK0; IP: GENERIC; ROOM: NONE; OriginalSymbolOrigin: (-75,25); XY: (1725,2300); VER: 1; ROT: 0; PHYS_PAGE: 256; LOCATION: R10285; DRAWING: @RVP1_ADL_SB_ADP_S_DDR5_SODIMM_2DPC_LIB.H55_DG2_2DPC(SCH_1):PAGE368; CDS_LIB: c_discrete; VARIANT: ?; PCB Footprint: CTK0_SM0402_1100X550_MA; CDS_PART_NAME: C_RES_0402-A93548-060,RES,200,1%,0.0625W,TK0,GENERIC; CDS_LOCATION: R10285
R10286 = C_RES#1: CHIPS_PART_NAME: C_RES; CDS_PHYS_PART_NAME: C_RES_0402-A93548-060,RES,200,1%,0.0625W,TK0,GENERIC; CDS_LMAN_SYM_OUTLINE: -50,50,50,-50; FP_TECH: TK0; IP: GENERIC; ROOM: NONE; OriginalSymbolOrigin: (-75,25); XY: (1125,1550); VER: 1; ROT: 0; PHYS_PAGE: 256; LOCATION: R10286; DRAWING: @RVP1_ADL_SB_ADP_S_DDR5_SODIMM_2DPC_LIB.H55_DG2_2DPC(SCH_1):PAGE368; CDS_LIB: c_discrete; VARIANT: ?; PCB Footprint: CTK0_SM0402_1100X550_MA; CDS_PART_NAME: C_RES_0402-A93548-060,RES,200,1%,0.0625W,TK0,GENERIC; CDS_LOCATION: R10286
R10287 = RES#1: CHIPS_PART_NAME: RES; CDS_PHYS_PART_NAME: RES_0201-J75914-001,CHIP,2M,1%,1/20W,LPDB,GENERIC; OriginalSymbolOrigin: (-75,25); XY: (1625,950); VER: 1; ROT: 3; PHYS_PAGE: 256; LOCATION: R10287; IP: GENERIC; FP_TECH: LPDB; DRAWING: @RVP1_ADL_SB_ADP_S_DDR5_SODIMM_2DPC_LIB.H55_DG2_2DPC(SCH_1):PAGE368; CDS_LIB: discrete; MATERIAL: CHIP; PCB Footprint: SMR0201IA; CDS_PART_NAME: RES_0201-J75914-001,CHIP,2M,1%,1/20W,LPDB,GENERIC; CDS_LOCATION: R10287
R10289 = RES: CDS_PHYS_PART_NAME: RES_0402-G64084-001,CHIP,0,5%,1/16W,LPDB,GENERIC; OriginalSymbolOrigin: (-25,75); XY: (2225,1550); VER: 2; PHYS_PAGE: 256; LOCATION: R10289; IP: GENERIC; FP_TECH: LPDB; DRAWING: @RVP1_ADL_SB_ADP_S_DDR5_SODIMM_2DPC_LIB.H55_DG2_2DPC(SCH_1):PAGE368; CDS_LIB: discrete; PCB Footprint: SMR0402IA; ROT: 0; CHIPS_PART_NAME: RES; CDS_PART_NAME: RES_0402-G64084-001,CHIP,0,5%,1/16W,LPDB,GENERIC; CDS_LOCATION: R10289
R10291 = RES#1: CHIPS_PART_NAME: RES; CDS_PHYS_PART_NAME: RES_0201-J75967-001,CHIP,133K,1%,1/20W,LPDB,GENERIC; OriginalSymbolOrigin: (-75,25); XY: (2625,650); VER: 1; ROT: 0; PHYS_PAGE: 256; LOCATION: R10291; DRAWING: @RVP1_ADL_SB_ADP_S_DDR5_SODIMM_2DPC_LIB.H55_DG2_2DPC(SCH_1):PAGE368; CDS_LIB: discrete; PCB Footprint: SMR0201IA; CDS_PART_NAME: RES_0201-J75967-001,CHIP,133K,1%,1/20W,LPDB,GENERIC; CDS_LOCATION: R10291
R10297 = RES_2: CDS_PHYS_PART_NAME: RES_2_0201-C48657-254,RES,1.5K,1%,0.05W,TK0,GENERIC; BOM_USE: STUFF; CDS_LMAN_SYM_OUTLINE: -50,50,50,-50; FP_TECH: TK0; IP: GENERIC; ROOM: NONE; OriginalSymbolOrigin: (-25,75); XY: (5875,3375); VER: 2; ROT: 0; PHYS_PAGE: 256; LOCATION: R10297; DRAWING: @RVP1_ADL_SB_ADP_S_DDR5_SODIMM_2DPC_LIB.H55_DG2_2DPC(SCH_1):PAGE368; CDS_LIB: discrete_2; VARIANT: ?; PCB Footprint: TK0_SM0201_630X330_MC; CHIPS_PART_NAME: RES_2; CDS_PART_NAME: RES_2_0201-C48657-254,RES,1.5K,1%,0.05W,TK0,GENERIC; CDS_LOCATION: R10297
R10299 = RES_2: CDS_PHYS_PART_NAME: RES_2_0201-C48657-254,RES,1.5K,1%,0.05W,TK0,GENERIC; BOM_USE: STUFF; CDS_LMAN_SYM_OUTLINE: -50,50,50,-50; FP_TECH: TK0; IP: GENERIC; ROOM: NONE; OriginalSymbolOrigin: (-25,75); XY: (6325,3350); VER: 2; ROT: 0; PHYS_PAGE: 256; LOCATION: R10299; DRAWING: @RVP1_ADL_SB_ADP_S_DDR5_SODIMM_2DPC_LIB.H55_DG2_2DPC(SCH_1):PAGE368; CDS_LIB: discrete_2; VARIANT: ?; PCB Footprint: TK0_SM0201_630X330_MC; CHIPS_PART_NAME: RES_2; CDS_PART_NAME: RES_2_0201-C48657-254,RES,1.5K,1%,0.05W,TK0,GENERIC; CDS_LOCATION: R10299
R11204 = RES_2: CDS_PHYS_PART_NAME: RES_2_0201-C48657-254,RES,1.5K,1%,0.05W,TK0,GENERIC; BOM_USE: STUFF; CDS_LMAN_SYM_OUTLINE: -50,50,50,-50; FP_TECH: TK0; IP: GENERIC; ROOM: NONE; OriginalSymbolOrigin: (-25,75); XY: (6725,3350); VER: 2; ROT: 0; PHYS_PAGE: 256; LOCATION: R11204; DRAWING: @RVP1_ADL_SB_ADP_S_DDR5_SODIMM_2DPC_LIB.H55_DG2_2DPC(SCH_1):PAGE368; CDS_LIB: discrete_2; VARIANT: ?; PCB Footprint: TK0_SM0201_630X330_MC; CHIPS_PART_NAME: RES_2; CDS_PART_NAME: RES_2_0201-C48657-254,RES,1.5K,1%,0.05W,TK0,GENERIC; CDS_LOCATION: R11204
R28104 = RES_2#1: CHIPS_PART_NAME: RES_2; CDS_PHYS_PART_NAME: RES_2_0201-C80792-009,EMPTY,0,1%,0.05W,TK0,GENERIC; BOM_USE: STUFF; CDS_LMAN_SYM_OUTLINE: -50,50,50,-50; FP_TECH: TK0; IP: GENERIC; ROOM: NONE; OriginalSymbolOrigin: (-75,25); XY: (1425,3650); VER: 1; PHYS_PAGE: 256; LOCATION: R28104; DRAWING: @RVP1_ADL_SB_ADP_S_DDR5_SODIMM_2DPC_LIB.H55_DG2_2DPC(SCH_1):PAGE368; CDS_LIB: discrete_2; VARIANT: ?; PCB Footprint: TK0_SM0201_630X330_MC; ROT: 0; CDS_PART_NAME: RES_2_0201-C80792-009,EMPTY,0,1%,0.05W,TK0,GENERIC; CDS_LOCATION: R28104
R31401 = RES_2: CDS_PHYS_PART_NAME: RES_2_0201-C48657-027,RES,0,0%,1/20W,TK0,GENERIC; BOM_USE: STUFF; CDS_LMAN_SYM_OUTLINE: -50,50,50,-50; FP_TECH: TK0; IP: GENERIC; ROOM: NONE; OriginalSymbolOrigin: (-25,75); XY: (750,375); VER: 2; PHYS_PAGE: 256; LOCATION: R31401; DRAWING: @RVP1_ADL_SB_ADP_S_DDR5_SODIMM_2DPC_LIB.H55_DG2_2DPC(SCH_1):PAGE368; CDS_LIB: discrete_2; VARIANT: ?; PCB Footprint: TK0_SM0201_630X330_MB; ROT: 0; CHIPS_PART_NAME: RES_2; CDS_PART_NAME: RES_2_0201-C48657-027,RES,0,0%,1/20W,TK0,GENERIC; CDS_LOCATION: R31401